# EAGLE design levelshifter (EAGLE 7.6.0)
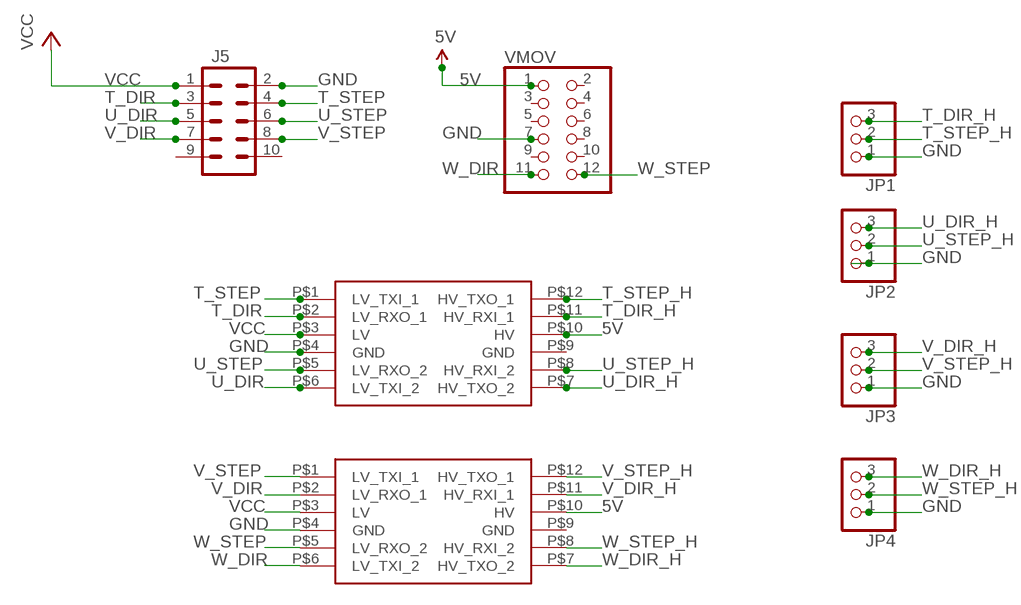
[diagram p0: schematic, sheet 1]

## Parts
CP  LOGIC_LEVEL_CONVERTER  [LOGIC_LEVEL_CONVERTER]
CP1  LOGIC_LEVEL_CONVERTER  [LOGIC_LEVEL_CONVERTER]
J5  M05X2PTH  [AVR_ICSP]
JP1  PINHD-1X3  [1X03]
JP2  PINHD-1X3  [1X03]
JP3  PINHD-1X3  [1X03]
JP4  PINHD-1X3  [1X03]
VMOV  PINHD-2X6  [2X06]

## Nets
5V: CP1.P$10(HV) CP.P$10(HV) VMOV.1
GND: CP1.P$4(GND) CP.P$4(GND) J5.2 JP1.1 JP2.1 JP3.1 JP4.1 VMOV.7
T_DIR: CP.P$2(LV_RXO_1) J5.3
T_DIR_H: CP.P$11(HV_RXI_1) JP1.3
T_STEP: CP.P$1(LV_TXI_1) J5.4
T_STEP_H: CP.P$12(HV_TXO_1) JP1.2
U_DIR: CP.P$6(LV_TXI_2) J5.5
U_DIR_H: CP.P$7(HV_TXO_2) JP2.3
U_STEP: CP.P$5(LV_RXO_2) J5.6
U_STEP_H: CP.P$8(HV_RXI_2) JP2.2
V_DIR: CP1.P$2(LV_RXO_1) J5.7
V_DIR_H: CP1.P$11(HV_RXI_1) JP3.3
V_STEP: CP1.P$1(LV_TXI_1) J5.8
V_STEP_H: CP1.P$12(HV_TXO_1) JP3.2
VCC: CP1.P$3(LV) CP.P$3(LV) J5.1
W_DIR: CP1.P$6(LV_TXI_2) VMOV.11
W_DIR_H: CP1.P$7(HV_TXO_2) JP4.3
W_STEP: CP1.P$5(LV_RXO_2) VMOV.12
W_STEP_H: CP1.P$8(HV_RXI_2) JP4.2
Unconnected: CP1.P$9(GND) CP.P$9(GND) J5.9 J5.10 VMOV.2 VMOV.3 VMOV.4 VMOV.5 VMOV.6 VMOV.8 VMOV.9 VMOV.10

## Library data of the parts
CP CP1 = SparkFun-Boards:LOGIC_LEVEL_CONVERTER: Logic Level Converter (3.3v - 5v) https://www.sparkfun.com/products/8745
J5 = SparkFun-Connectors:M05X2: Header 5x2 Standard 10-pin dual row 0.1" header. Commonly used with AVR-ISP. Use with Spark Fun Electronics SKU: PRT-00778
JP1-JP4 = pinhead:PINHD-1X3: PIN HEADER
VMOV = pinhead:PINHD-2X6: PIN HEADER

## Board
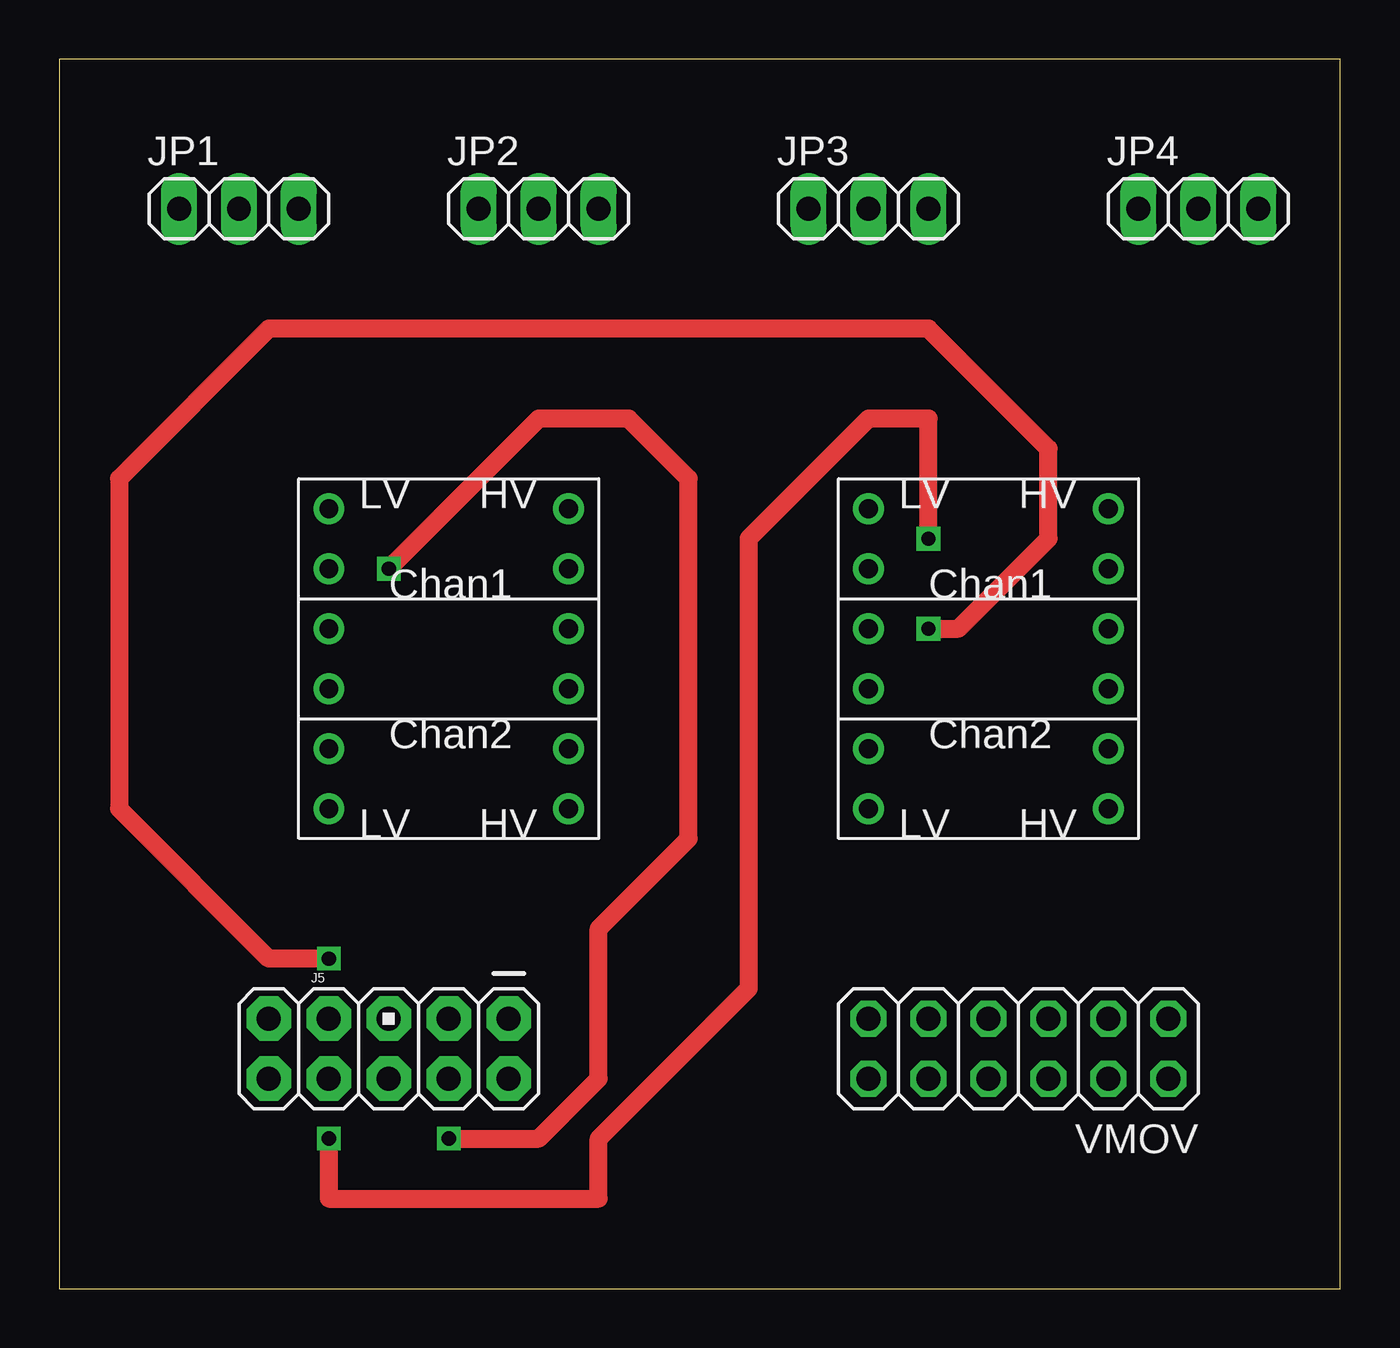
[diagram p1: board, top side]
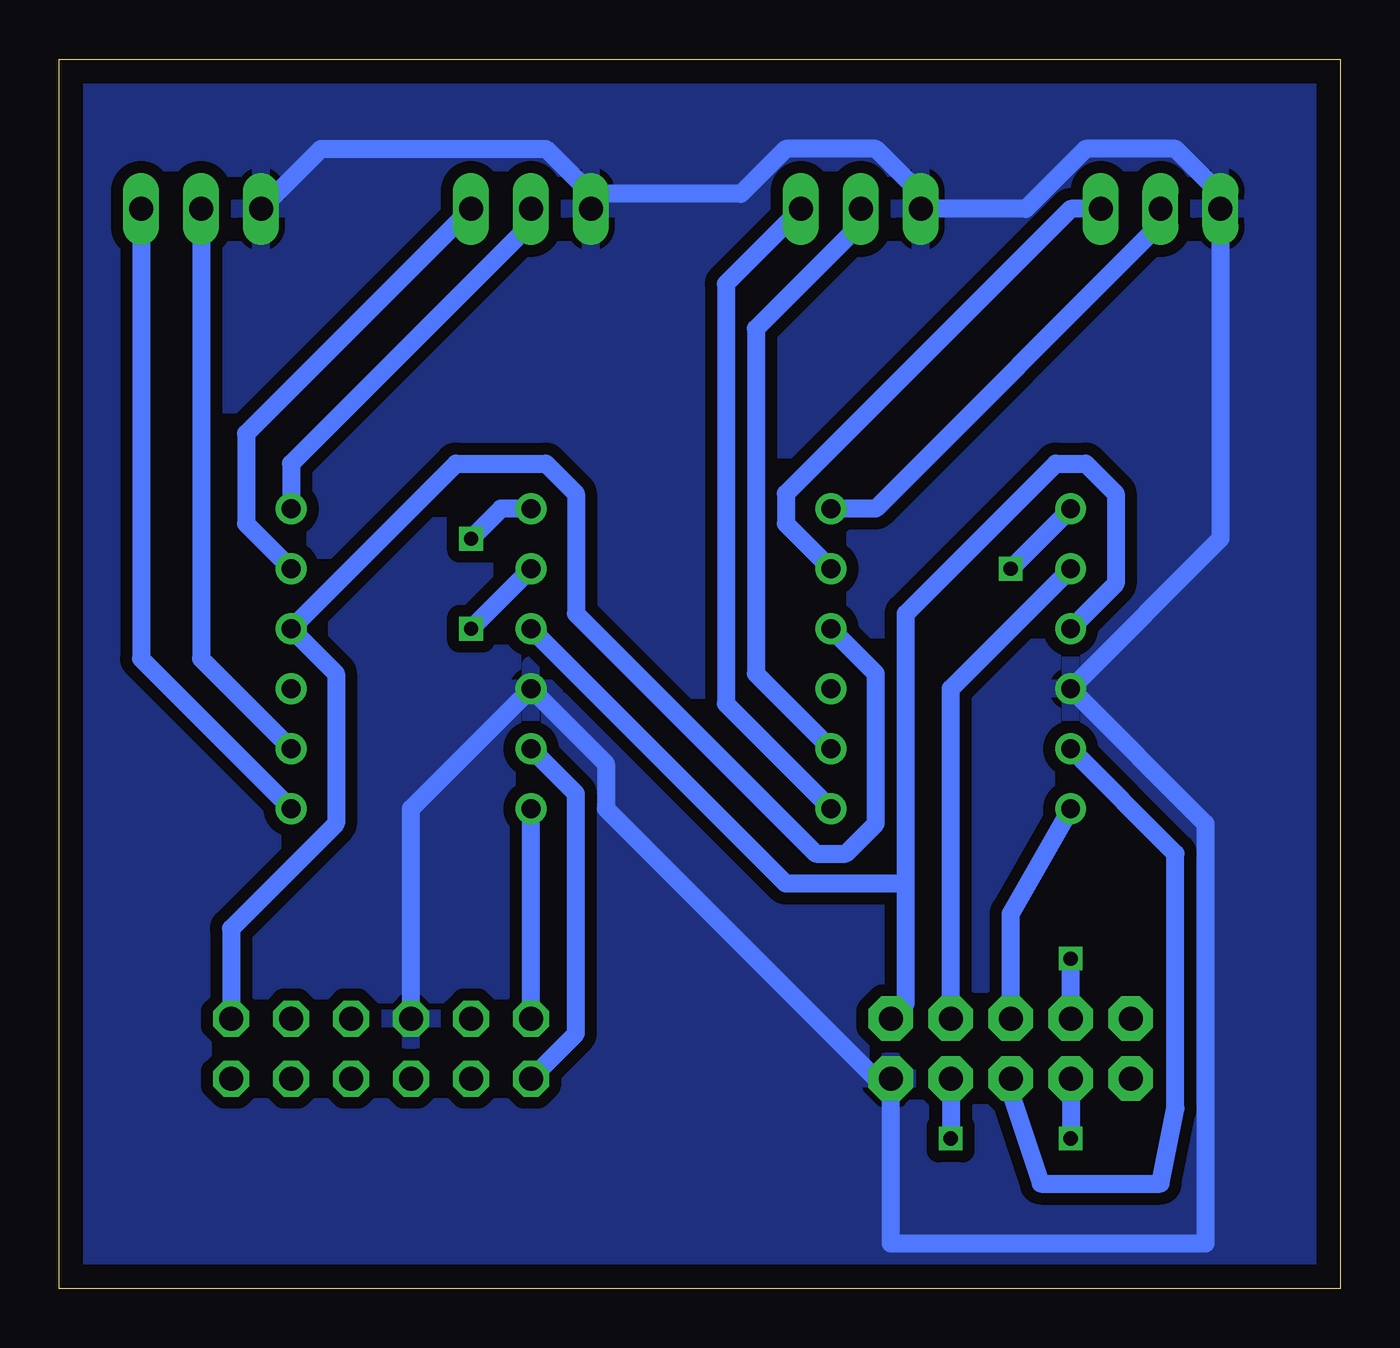
[diagram p2: board, bottom side, seen from below]

Size 54.28 x 52.06 mm. Coordinates in mm from the lower left corner, seen from the top.
Outline: 0,0 54.28,0 54.28,52.06 0,52.06 0,0
Copper layers (1*16): Top 0.035mm / dielectric 1.5mm / Bottom 0.035mm
Design rules "default *": minimum track width 30mil, minimum drill 24mil, track to track 20mil, track to pad 20mil, pad to pad 20mil, via to via 20mil, smd to smd 20mil, copper to edge 40mil, drill to drill 8mil, minimum pad ring 10mil, minimum via ring 8mil, stop-mask expansion 4mil, vias tented up to drill 0mil, thermal gap 10mil

### Footprints (pad centres in the part's own frame; a part is rotated, then mirrored left to right if it is on the bottom)
LOGIC_LEVEL_CONVERTER = drill 0.8: P$1 1.27,13.97; P$2 1.27,11.43; P$3 1.27,8.89; P$4 1.27,6.35; P$5 1.27,3.81; P$6 1.27,1.27; P$7 11.43,1.27; P$8 11.43,3.81; P$9 11.43,6.35; P$10 11.43,8.89; P$11 11.43,11.43; P$12 11.43,13.97
AVR_ICSP = drill 1.016 pad 1.88 octagon: 1 -1.27,5.08; 2 1.27,5.08; 3 -1.27,2.54; 4 1.27,2.54; 5 -1.27,0; 6 1.27,0; 7 -1.27,-2.54; 8 1.27,-2.54; 9 -1.27,-5.08; 10 1.27,-5.08
1X03 = drill 1.016 long: 1 -2.54,0; 2 0,0; 3 2.54,0
2X06 = drill 1.016 octagon: 1 -6.35,-1.27; 2 -6.35,1.27; 3 -3.81,-1.27; 4 -3.81,1.27; 5 -1.27,-1.27; 6 -1.27,1.27; 7 1.27,-1.27; 8 1.27,1.27; 9 3.81,-1.27; 10 3.81,1.27; 11 6.35,-1.27; 12 6.35,1.27

### Placement (x,y rotation side)
CP  10.16,19.05 0 top
CP1  33.02,19.05 0 top
J5  13.97,10.16 270 top
JP1  7.62,45.72 0 top
JP2  20.32,45.72 0 top
JP3  34.29,45.72 0 top
JP4  48.26,45.72 0 top
VMOV  40.64,10.16 180 top

### Tracks (layer width: path | path; a pad name or v marks a point on that pad's centre or on a via)
5V
  Bottom 0.762: CP.P$10 19.68,26.04 19.68,19.68 20.95,18.41 22.23,18.41 32.38,28.57 32.38,33.66 33.66,34.92 37.47,34.92 CP1.P$10 42.55,26.04 42.55,19.68 46.99,15.24 VMOV.1
GND
  Bottom 0.762: VMOV.7 39.37,20.32 CP1.P$4 31.11,22.23 31.11,20.32 19.68,8.89 J5.2 19.05,1.91 5.71,1.91 5.71,19.68 CP.P$4 5.08,31.75 JP1.1 5.08,46.35 6.99,48.26 10.79,48.26 13.34,45.72 17.14,45.72 | 31.75,46.35 33.66,48.26 43.18,48.26 JP4.1 | 31.75,46.35 25.4,46.35 23.5,48.26 19.68,48.26 17.14,45.72 | 31.75,46.35 JP3.1 | 17.14,45.72 JP2.1
  pour Bottom: 0,0 54.61,0 54.61,52.07 0,52.07
T_DIR
  Bottom 0.762: CP.P$2 16.51,25.4 J5.3
T_DIR_H
  Bottom 0.762: CP.P$11 23.5,32.38 23.5,33.66 11.43,45.72 JP1.3
T_STEP  (via drill 0.6)
  Top 0.762: v16.51,6.35 20.32,6.35 22.86,8.89 22.86,15.24 26.67,19.05 26.67,34.29 24.13,36.83 20.32,36.83 v13.97,30.48
  Bottom 0.762: J5.4 v16.51,6.35 | v13.97,30.48 CP.P$1
T_STEP_H
  Bottom 0.762: CP.P$12 19.68,33.02 7.62,45.09 JP1.2
U_DIR
  Bottom 0.762: CP.P$6 13.97,15.88 J5.5
U_DIR_H
  Bottom 0.762: CP.P$7 26.04,24.77 26.04,42.55 JP2.3
U_STEP
  Bottom 0.762: CP.P$5 6.99,18.41 6.99,7.62 7.62,4.45 12.7,4.45 13.97,8.26 J5.6
U_STEP_H
  Bottom 0.762: CP.P$8 24.77,26.04 24.77,40.64 20.32,45.09 JP2.2
V_DIR  (via drill 0.6)
  Top 0.762: v36.83,27.94 38.1,27.94 41.91,31.75 41.91,35.56 36.83,40.64 8.89,40.64 2.54,34.29 2.54,20.32 8.89,13.97 v11.43,13.97
  Bottom 0.762: CP1.P$2 v36.83,27.94 | J5.7 v11.43,13.97
V_DIR_H
  Bottom 0.762: CP1.P$11 46.35,32.38 46.35,36.2 JP3.3
V_STEP  (via drill 0.6)
  Top 0.762: v36.83,31.75 36.83,36.83 34.29,36.83 29.21,31.75 29.21,12.7 22.86,6.35 22.86,3.81 11.43,3.81 v11.43,6.35
  Bottom 0.762: CP1.P$1 35.56,33.02 v36.83,31.75 | J5.8 v11.43,6.35
V_STEP_H
  Bottom 0.762: CP1.P$12 44.45,34.92 34.29,45.09 JP3.2
VCC
  Bottom 0.762: CP.P$3 9.53,29.84 9.53,33.66 10.79,34.92 12.06,34.92 18.41,28.57 18.41,17.14 | 18.41,17.14 18.41,12.06 J5.1 | CP1.P$3 23.5,17.14 18.41,17.14
W_DIR
  Bottom 0.762: VMOV.11 CP1.P$6
W_DIR_H
  Bottom 0.762: CP1.P$7 50.8,26.67 JP4.3
W_STEP
  Bottom 0.762: CP1.P$5 32.38,20.95 32.38,10.79 VMOV.12
W_STEP_H
  Bottom 0.762: CP1.P$8 48.26,26.67 JP4.2